# EAGLE design Moteino Trail Counter (EAGLE 6.5.0)
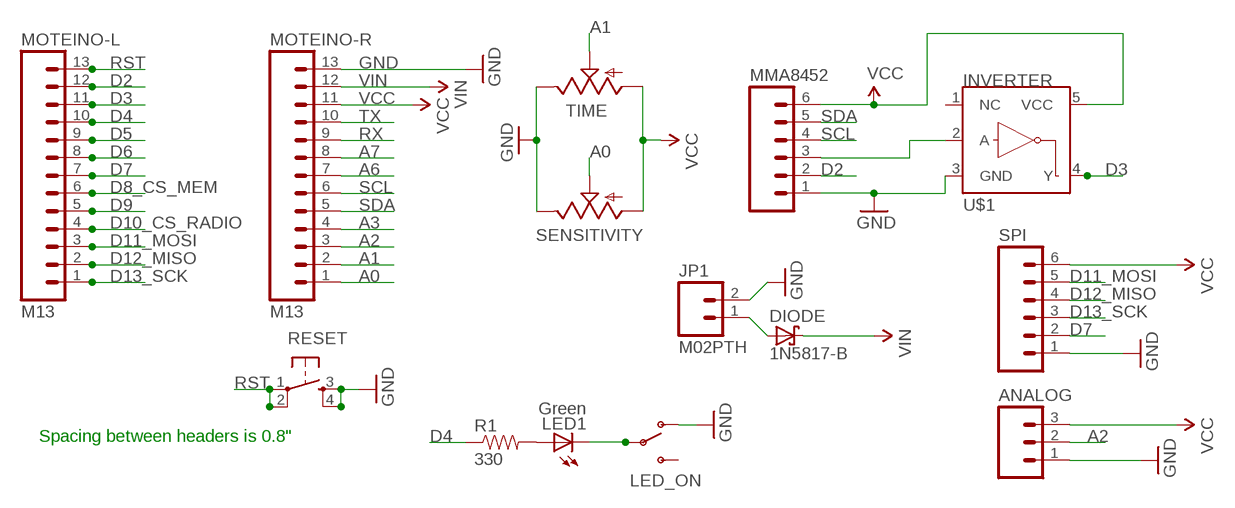
[diagram p0: schematic, sheet 1]

## Parts
ANALOG  M03LOCK  [1X03_LOCK]
DIODE  1N5817-B  [DO41-7.6]
JP1  M02PTH  [1X02]
LED1  Green  LED3MM  [LED3MM]
LED_ON  SWITCH-SPDTPTH  [SWITCH-SPDT]
MMA8452  M06LOCK  [1X06_LOCK]
MOTEINO-L  M13  [1X13]
MOTEINO-R  M13  [1X13]
R1  330  RESISTORAXIAL-0.3  [AXIAL-0.3]
RESET  TAC_SWITCHPTH  [TACTILE-PTH]
SENSITIVITY  TRIM_US-B25U  [B25U]
SPI  M06LOCK  [1X06_LOCK]
TIME  TRIM_US-B25U  [B25U]
U$1  INVERTER  [SOT23-5]

## Nets
A0: MOTEINO-R.1 SENSITIVITY.S
A1: MOTEINO-R.2 TIME.S
A2: ANALOG.2 MOTEINO-R.3
A3: MOTEINO-R.4
A6: MOTEINO-R.7
A7: MOTEINO-R.8
D2: MMA8452.2 MOTEINO-L.12
D3: MOTEINO-L.11 U$1.4(Y)
D4: MOTEINO-L.10 R1.P$1
D5: MOTEINO-L.9
D6: MOTEINO-L.8
D7: MOTEINO-L.7 SPI.2
D8_CS_MEM: MOTEINO-L.6
D9: MOTEINO-L.5
D10_CS_RADIO: MOTEINO-L.4
D11_MOSI: MOTEINO-L.3 SPI.5
D12_MISO: MOTEINO-L.2 SPI.4
D13_SCK: MOTEINO-L.1 SPI.3
GND: ANALOG.1 JP1.2 LED_ON.1(O) MMA8452.1 MOTEINO-R.13 RESET.3 RESET.4 SENSITIVITY.E SPI.1 TIME.E U$1.3(GND)
N$1: DIODE.A JP1.1
N$2: LED1.A R1.P$2
N$3: MMA8452.3 U$1.2(A)
N$4: LED1.K(C) LED_ON.2(P)
RST: MOTEINO-L.13 RESET.1 RESET.2
RX: MOTEINO-R.9
SCL: MMA8452.4 MOTEINO-R.6
SDA: MMA8452.5 MOTEINO-R.5
TX: MOTEINO-R.10
VCC: ANALOG.3 MMA8452.6 MOTEINO-R.11 SENSITIVITY.A SPI.6 TIME.A U$1.5(VCC)
VIN: DIODE.C MOTEINO-R.12
Unconnected: LED_ON.3(S) U$1.1(NC)

## Notes on the sheet
- Spacing between headers is 0.8"

## Library data of the parts
ANALOG = SparkFun-Connectors:M03: Header 3 Standard 3-pin 0.1" header. Use with straight break away headers (SKU : PRT-00116), right angle break away headers (PRT-00553), swiss pins (PRT-00743), machine pins (PRT-00117), and female headers (PRT-00115). Molex polarized connector foot print use with SKU : PRT-08232 with associated crimp pins and housings.
DIODE = diode:1N581*: 1.0A SCHOTTKY BARRIER RECTIFIER Source: http://www.diodes.com/datasheets/ds23001.pdf
JP1 = SparkFun-Connectors:M02: Standard 2-pin 0.1" header. Use with - straight break away headers ( PRT-00116) - right angle break away headers (PRT-00553) - swiss pins (PRT-00743) - machine pins (PRT-00117) - female headers (PRT-00115) Molex polarized connector foot print use with: PRT-08233 with associated crimp pins and housings. 2.54_SCREWTERM for use with PRT-10571. 3.5mm Screw Terminal footprints for PRT-08084 5mm Screw Terminal footprints for use with PRT-08433
LED1 = led:LED: LED OSRAM: - CHIPLED LG R971, LG N971, LY N971, LG Q971, LY Q971, LO R971, LY R971 LH N974, LH R974 LS Q976, LO Q976, LY Q976 LO Q996 - Hyper CHIPLED LW Q18S LB Q993, LB Q99A, LB R99A - SideLED LS A670, LO A670, LY A670, LG A670, LP A670 LB A673, LV A673, LT A673, LW A673 LH A674 LY A675 LS A676, LA A676, LO A676, LY A676, LW A676 LS A679, LY A679, LG A679 - Hyper Micro SIDELED® LS Y876, LA Y876, LO Y876, LY Y876 LT Y87S - SmartLED LW L88C, LW L88S LB L89C, LB L89S, LG L890 LS L89K, LO L89K, LY L89K LS L896, LA L896, LO L896, LY L896 - TOPLED LS T670, LO T670, LY T670, LG T670, LP T670 LSG T670, LSP T670, LSY T670, LOP T670, LYG T670 LG T671, LOG T671, LSG T671 LB T673, LV T673, LT T673, LW T673 LH T674 LS T676, LA T676, LO T676, LY T676, LB T676, LH T676, LSB T676, LW T676 LB T67C, LV T67C, LT T67C, LS T67K, LO T67K, LY T67K, LW E67C LS E67B, LA E67B, LO E67B, LY E67B, LB E67C, LV E67C, LT E67C LW T67C LS T679, LY T679, LG T679 LS T770, LO T770, LY T770, LG T770, LP T770 LB T773, LV T773, LT T773, LW T773 LH T774 LS E675, LA E675, LY E675, LS T675 LS T776, LA T776, LO T776, LY T776, LB T776 LHGB T686 LT T68C, LB T68C - Hyper Mini TOPLED® LB M676 - Mini TOPLED Santana® LG M470 LS M47K, LO M47K, LY M47K Source: http://www.osram.convergy.de LUXEON: - LUMILED® LXK2-PW12-R00, LXK2-PW12-S00, LXK2-PW14-U00, LXK2-PW14-V00 LXK2-PM12-R00, LXK2-PM12-S00, LXK2-PM14-U00 LXK2-PE12-Q00, LXK2-PE12-R00, LXK2-PE12-S00, LXK2-PE14-T00, LXK2-PE14-U00 LXK2-PB12-K00, LXK2-PB12-L00, LXK2-PB12-M00, LXK2-PB14-N00, LXK2-PB14-P00, LXK2-PB14-Q00 LXK2-PR12-L00, LXK2-PR12-M00, LXK2-PR14-Q00, LXK2-PR14-R00 LXK2-PD12-Q00, LXK2-PD12-R00, LXK2-PD12-S00 LXK2-PH12-R00, LXK2-PH12-S00 LXK2-PL12-P00, LXK2-PL12-Q00, LXK2-PL12-R00 Source: www.luxeon.com KINGBRIGHT: KA-3528ASYC Source: www.kingbright.com
LED_ON = SparkFun-Electromechanical:SWITCH-SPDT: SPDT Switch Simple slide switch, Spark Fun Electronics SKU : COM-00102 DPDT SMT slide switch, AYZ0202, SWCH-08179
MMA8452 SPI = SparkFun-Connectors:M06: Header 6 Standard 6-pin 0.1" header. Use with straight break away headers (SKU : PRT-00116), right angle break away headers (PRT-00553), swiss pins (PRT-00743), machine pins (PRT-00117), and female headers (PRT-00115). Molex polarized connector foot print use with SKU : PRT-08094 with associated crimp pins and housings. NOTES ON THE VARIANTS LOCK and LOCK_LONGPADS... This footprint was designed to help hold the alignment of a through-hole component (i.e. 6-pin header) while soldering it into place. You may notice that each hole has been shifted either up or down by 0.005 of an inch from it's more standard position (which is a perfectly straight line). This slight alteration caused the pins (the squares in the middle) to touch the edges of the holes. Because they are alternating, it causes a "brace" to hold the component in place. 0.005 has proven to be the perfect amount of "off-center" position when using our standard breakaway headers. Although looks a little odd when you look at the bare footprint, once you have a header in there, the alteration is very hard to notice. Also,if you push a header all the way into place, it is covered up entirely on the bottom side. This idea of altering the position of holes to aid alignment will be further integrated into the Sparkfun Library for other footprints. It can help hold any component with 3 or more connection pins.
MOTEINO-L MOTEINO-R = SparkFun-Connectors:M13: 13-pin single row .1" header
R1 = SparkFun-Resistors:RESISTOR: Resistor Basic schematic elements and footprints for 0603, 1206, and PTH resistors.
RESET = SparkFun-Electromechanical:TAC_SWITCH: Momentary Switch Button commonly used for reset or general input. Spark Fun Electronics SKU : COM-00097 SMT- SWCH-08247
SENSITIVITY TIME = pot:TRIM_US-: POTENTIOMETER
U$1 = SparkFun-DigitalIC:INVERTER: Single inverter, SOT23-5

## Board
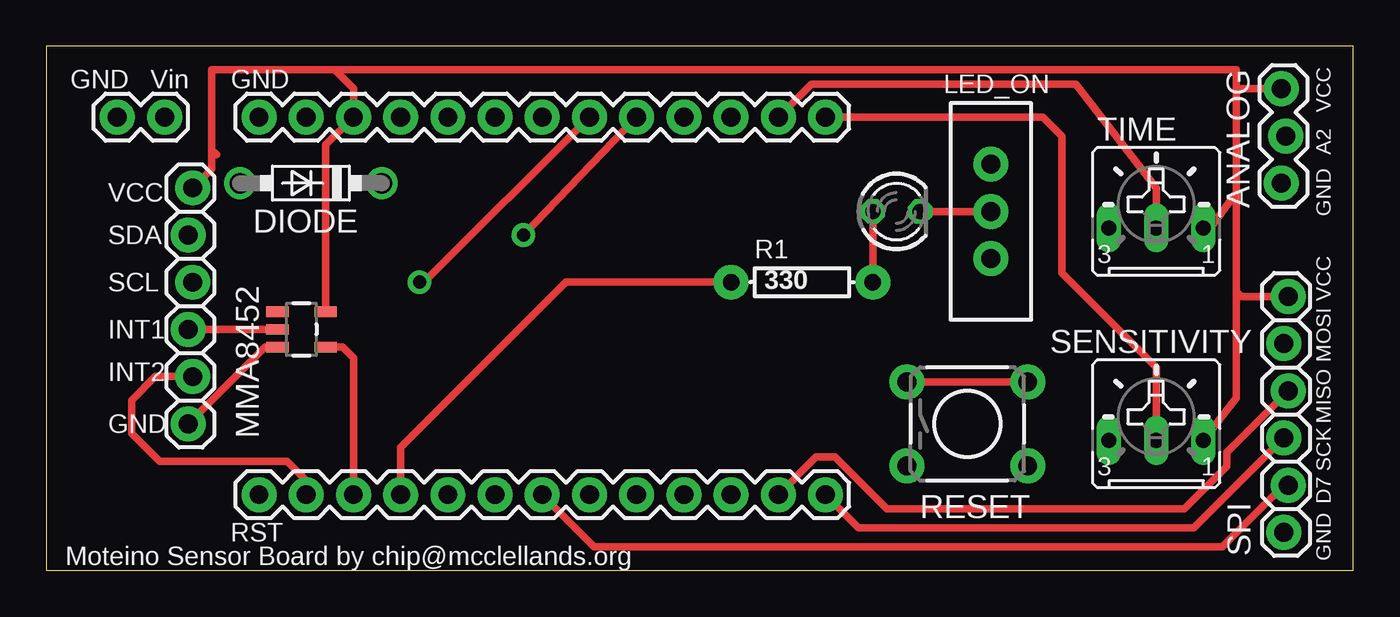
[diagram p1: board, top side]
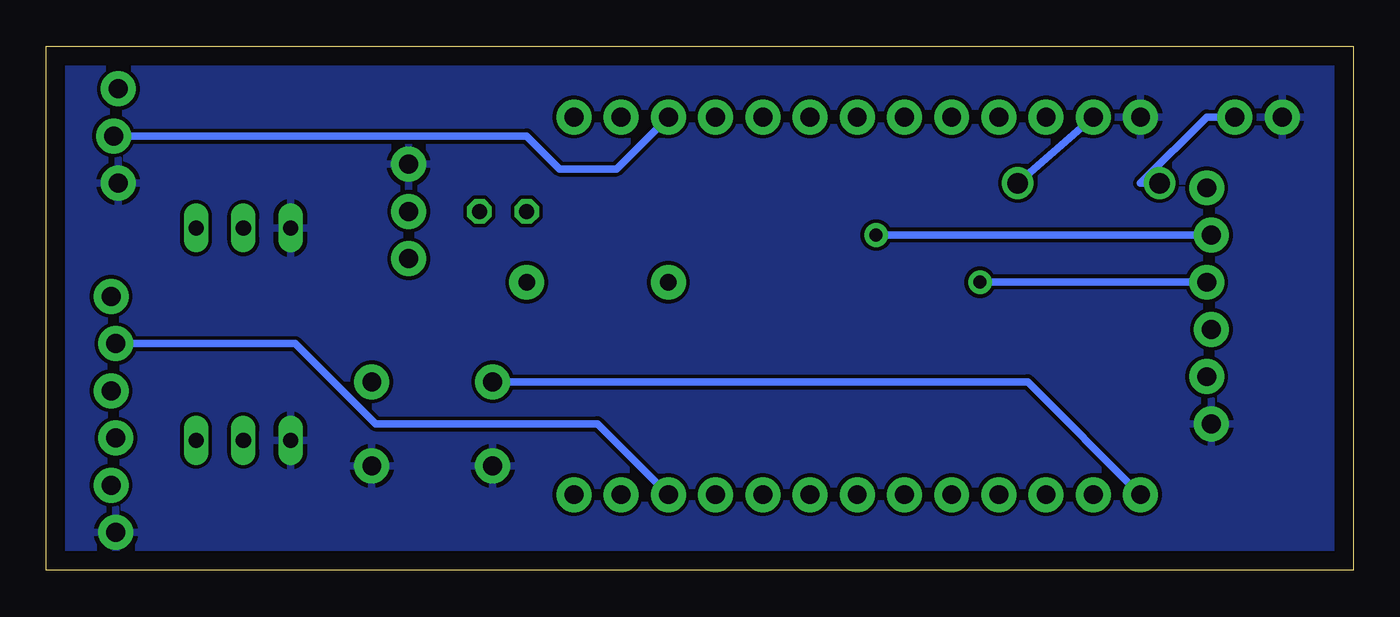
[diagram p2: board, bottom side, seen from below]

Size 70.28 x 28.18 mm. Coordinates in mm from the lower left corner, seen from the top.
Outline: 0,0 70.28,0 70.28,28.18 0,28.18 0,0
Copper layers (1*16): Top 0.035mm / dielectric 1.5mm / Bottom 0.035mm
Design rules "default": minimum track width 10mil, minimum drill 24mil, track to track 8mil, track to pad 8mil, pad to pad 8mil, via to via 8mil, smd to smd 8mil, copper to edge 40mil, drill to drill 8mil, minimum pad ring 10mil, minimum via ring 8mil, stop-mask expansion 4mil, vias tented up to drill 0mil, thermal gap 10mil

### Footprints (pad centres in the part's own frame; a part is rotated, then mirrored left to right if it is on the bottom)
1X03_LOCK = drill 1.016 pad 1.88: 1 0,0.127; 2 2.54,-0.127; 3 5.08,0.127
DO41-7.6 = drill 1.1 pad 1.7: A 3.81,0; C -3.81,0
1X02 = drill 1.016 pad 1.88: 1 0,0; 2 2.54,0
LED3MM = drill 0.813 octagon: A -1.27,0; K 1.27,0
SWITCH-SPDT = drill 1.016 pad 1.88: 1 0,2.54; 2 0,0; 3 0,-2.54
1X06_LOCK = drill 1.016 pad 1.88: 1 0,0; 2 2.54,-0.254; 3 5.08,0; 4 7.62,-0.254; 5 10.16,0; 6 12.7,-0.254
1X13 = drill 1.016 pad 1.88: 1 0,0; 2 2.54,0; 3 5.08,0; 4 7.62,0; 5 10.16,0; 6 12.7,0; 7 15.24,0; 8 17.78,0; 9 20.32,0; 10 22.86,0; 11 25.4,0; 12 27.94,0; 13 30.48,0
AXIAL-0.3 = drill 0.9 pad 1.88: P$1 -3.81,0; P$2 3.81,0
TACTILE-PTH = drill 1.016 pad 1.88: 1 -3.251,2.261; 2 3.251,2.261; 3 -3.251,-2.261; 4 3.251,-2.261
B25U = drill 0.813 long: A 2.54,-0.889; E -2.54,-0.889; S 0,-0.889
SOT23-5 = smd 0.55 x 1.2: 1 -0.95,-1.3; 2 0,-1.3; 3 0.95,-1.3; 4 0.95,1.3; 5 -0.95,1.3

### Placement (x,y rotation side)
ANALOG  66.55,20.83 90 top
DIODE  14.22,20.83 180 top
JP1  6.35,24.38 180 top
LED1  45.72,19.3 0 top
LED_ON  50.8,19.3 0 top
MMA8452  7.62,7.87 90 top
MOTEINO-L  41.91,4.06 180 top
MOTEINO-R  41.91,24.38 180 top
R1  40.64,15.49 0 top
RESET  49.53,7.87 0 top
SENSITIVITY  59.69,7.87 0 top
SPI  66.55,2.03 90 top
TIME  59.69,19.3 0 top
U$1  13.72,12.95 270 top

### Tracks (layer width: path | path; a pad name or v marks a point on that pad's centre or on a via)
A0
  Top 0.406: SENSITIVITY.S 59.69,10.92 54.61,16 54.61,23.37 53.59,24.38 MOTEINO-R.1
A1
  Top 0.406: TIME.S 59.69,20.57 55.37,26.16 41.15,26.16 MOTEINO-R.2
A2
  Bottom 0.406: ANALOG.2 44.45,23.37 42.67,21.59 39.62,21.59 MOTEINO-R.3
D2
  Top 0.406: MMA8452.2 5.84,10.41 4.57,9.14 4.57,7.37 6.1,5.84 12.95,5.84 13.97,4.83 MOTEINO-L.12
D3
  Top 0.406: 16.54,4.09 MOTEINO-L.11 16.51,11.43 15.94,12 U$1.4
D4
  Top 0.406: MOTEINO-L.10 19.05,6.6 27.94,15.49 R1.P$1
D7
  Top 0.406: SPI.2 66.55,4.57 63.25,1.27 29.46,1.27 MOTEINO-L.7
D11_MOSI
  Bottom 0.406: SPI.5 56.9,12.19 52.58,7.87 40.64,7.87 MOTEINO-L.3
D12_MISO
  Top 0.406: SPI.4 63.5,6.35 63.5,5.59 61.21,3.3 45.21,3.3 42.42,6.1 41.4,6.1 MOTEINO-L.2
D13_SCK
  Top 0.406: SPI.3 61.72,2.29 43.69,2.29 MOTEINO-L.1
GND
  Top 0.406: U$1.3 11.75,12 MMA8452.1
  pour Bottom: -2.54,29.46 71.12,29.21 71.12,-1.27 -2.54,-1.02
N$1
  Bottom 0.406: DIODE.A 11.43,20.83 7.87,24.38 JP1.1
N$2
  Top 0.406: R1.P$2 LED1.A
N$3
  Top 0.406: U$1.2 MMA8452.3
N$4
  Top 0.406: LED1.K LED_ON.2
RST
  Top 0.406: RESET.2 RESET.1
  Bottom 0.406: RESET.1 17.5,10.13 MOTEINO-L.13
SCL  (via drill 0.7 pad 1.27)
  Top 0.406: v20.07,15.49 20.32,15.49 MOTEINO-R.6
  Bottom 0.406: MMA8452.4 v20.07,15.49
SDA  (via drill 0.7 pad 1.27)
  Top 0.406: v25.65,18.03 MOTEINO-R.5
  Bottom 0.406: MMA8452.5 v25.65,18.03
VCC
  Top 0.406: 15.49,26.92 8.89,26.92 8.89,22.61 | 15.49,26.92 64.01,26.92 64.01,25.91 | 64.01,25.91 64.01,20.32 | 64.01,20.32 64.01,14.99 | 64.01,14.99 64.01,9.27 SENSITIVITY.A | 8.89,22.61 8.89,21.59 MMA8452.6 | MOTEINO-R.11 16.51,25.91 15.49,26.92 | TIME.A 62.61,18.41 64.01,20.32 | 9.14,22.35 8.89,22.61 | 16.54,24.35 MOTEINO-R.11 | ANALOG.3 64.01,25.91 | SPI.6 64.26,14.73 64.01,14.99 | U$1.5 15.02,22.89 MOTEINO-R.11
VIN
  Bottom 0.406: DIODE.C MOTEINO-R.12

### Text on the board
tPlace: GND | Vin | GND | VCC | A2 | VCC | GND | SDA | SCL | VCC | INT1 | MOSI | INT2 | MISO | GND | SCK | D7 | RST | GND | Moteino Sensor Board by chip@mcclellands.org